# EasyEDA schematic asynch9.json
TITLE: Sheet_1; REV: 1.0; Date: 2019-11-25; Sheet: 1/1; Drawn By: bianevesgarrido; Company: Your Company
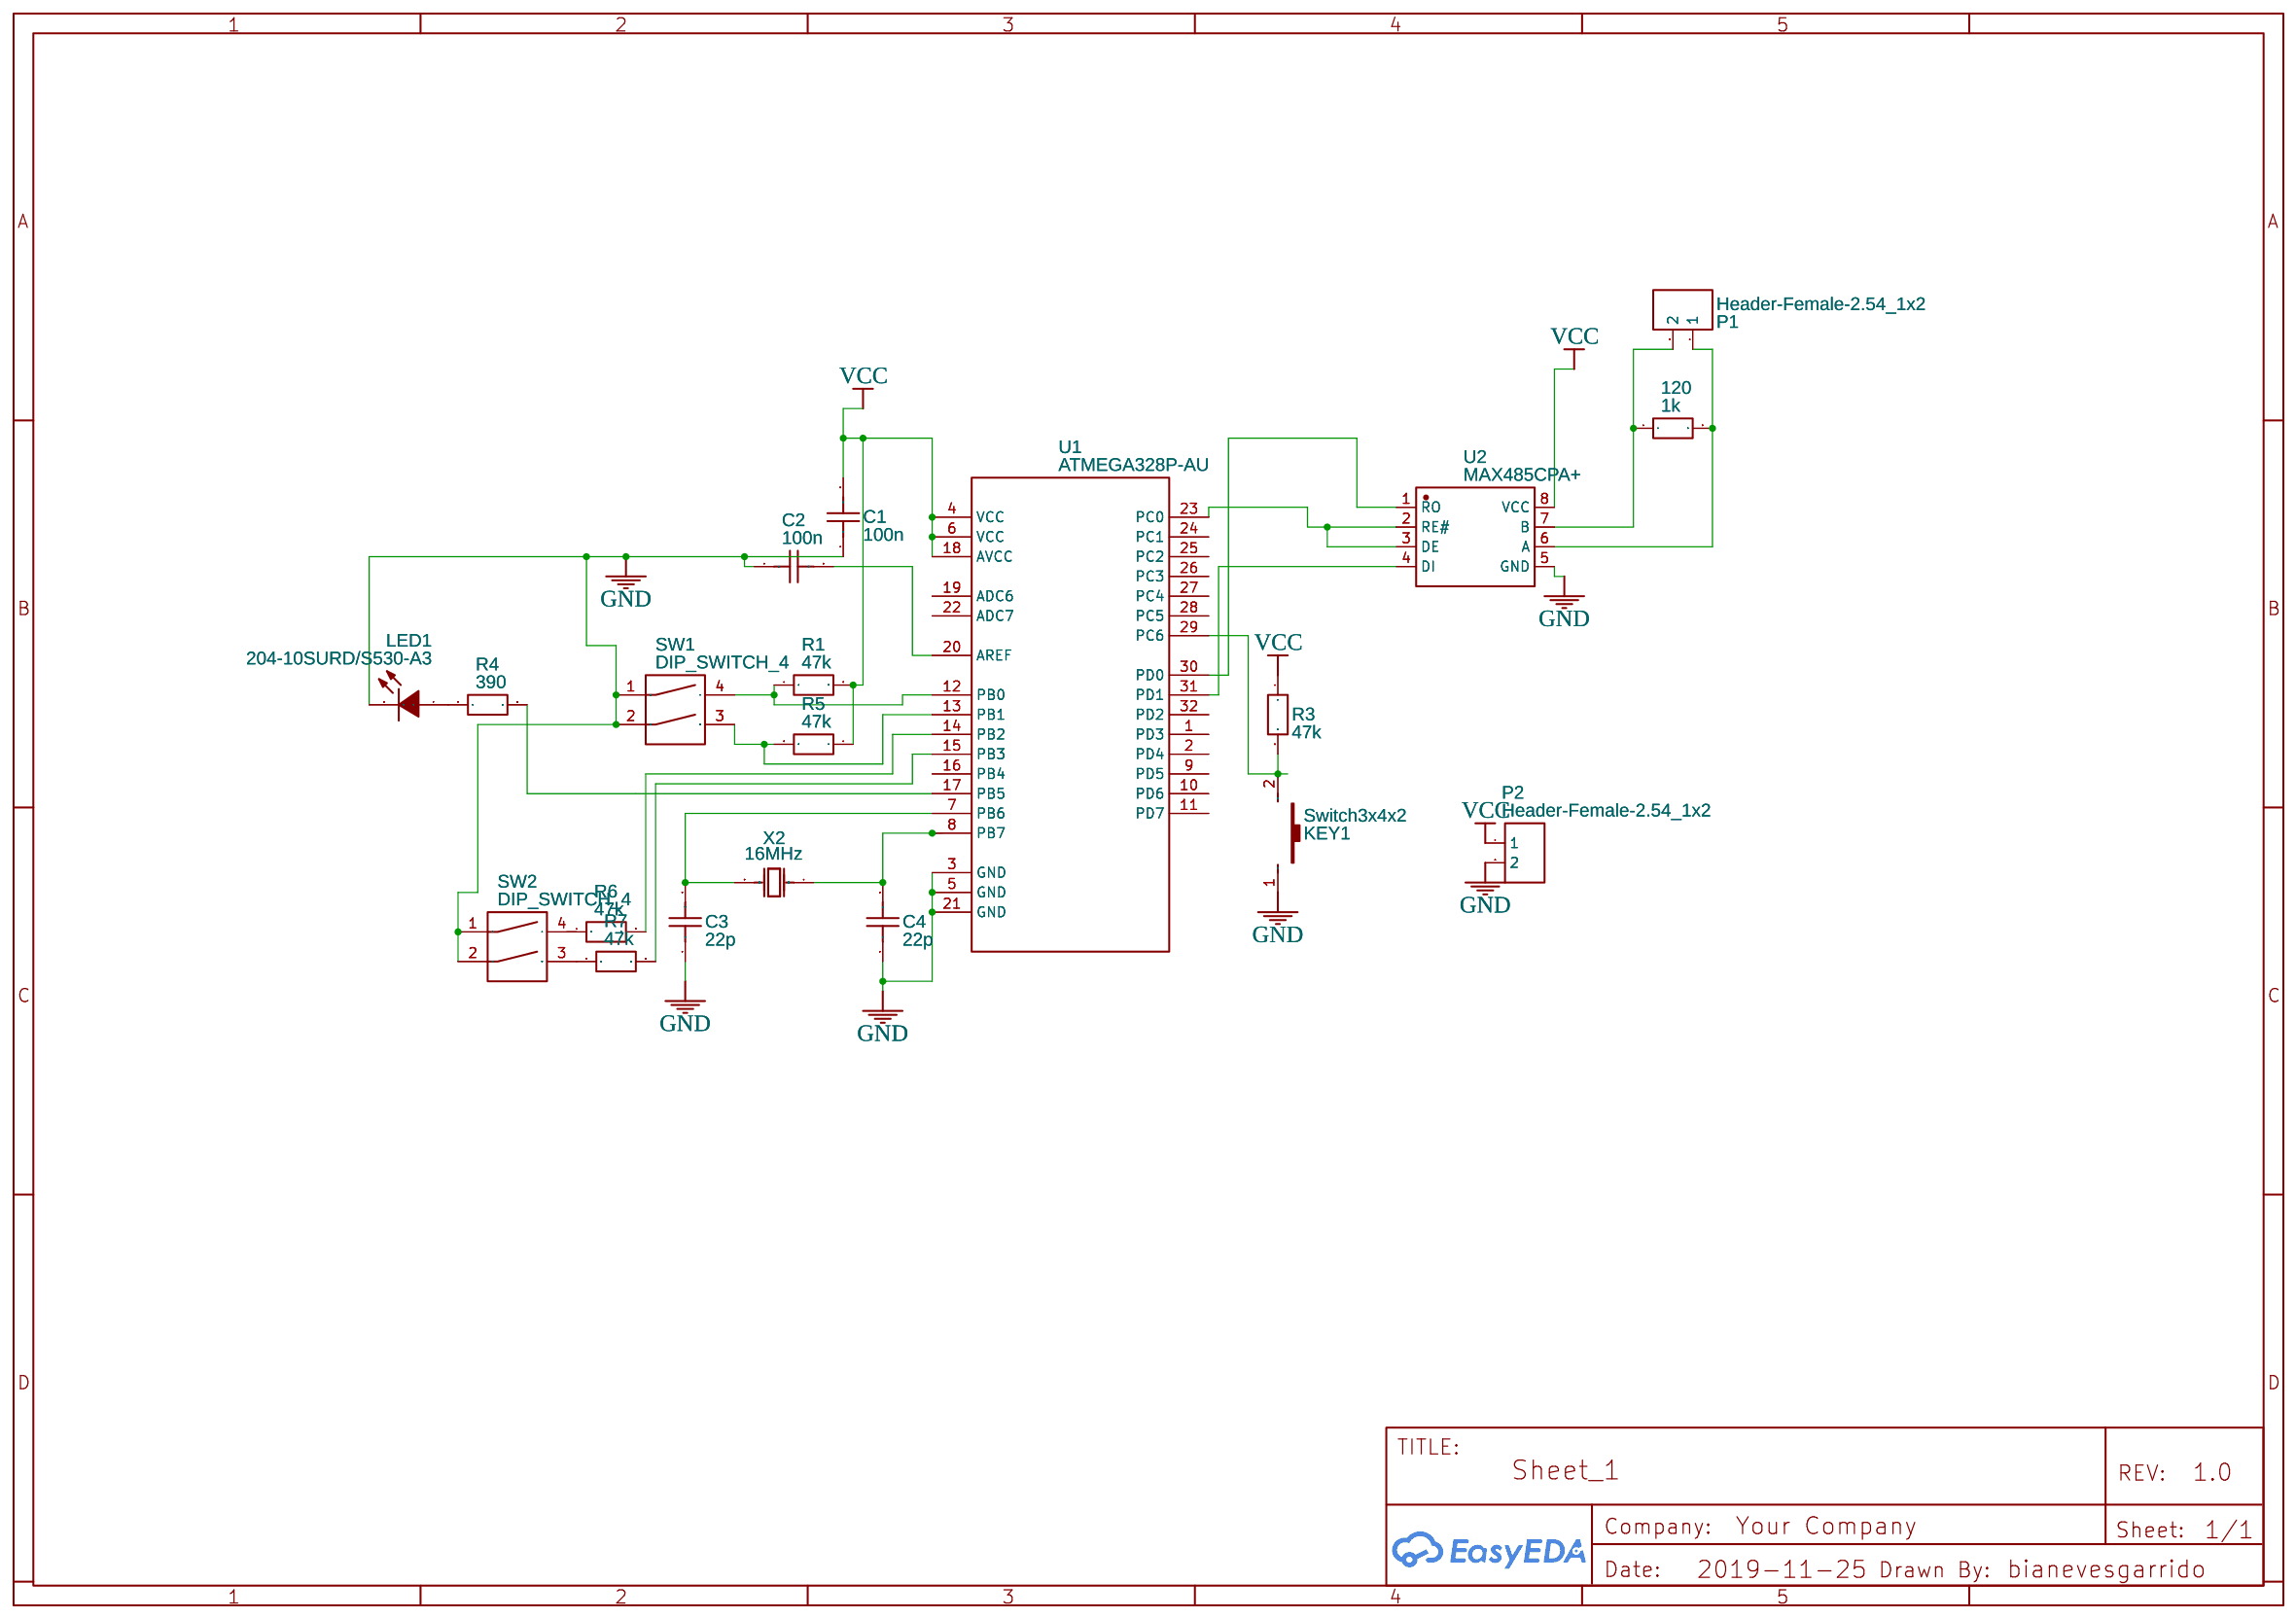
[diagram p0: schematic sheet]

## Parts
120  1k  [AXIAL-0.3]
C1  100n  [RAD-0.1]
C2  100n  [RAD-0.1]
C3  22p  [RAD-0.1]
C4  22p  [RAD-0.1]
KEY1  Switch3x4x2  [KEY-3.0*4.0]
LED1  204-10SURD/S530-A3  [LED-3MM/2.54]
P1  Header-Female-2.54_1x2  [HDR-1X2/2.54]
P2  Header-Female-2.54_1x2  [HDR-1X2/2.54]
R1  47k  [AXIAL-0.3]
R3  47k  [AXIAL-0.3]
R4  390  [AXIAL-0.3]
R5  47k  [AXIAL-0.3]
R6  47k  [AXIAL-0.3]
R7  47k  [AXIAL-0.3]
SW1  DIP_SWITCH_4
SW2  DIP_SWITCH_4
U1  ATMEGA328P-AU  [TQFP-32_L7.0-W7.0-P0.80-LS9.0-TL]
U2  MAX485CPA+  [DIP-8_L10.0-W6.5-P2.54-LS7.6-BL]
X2  16MHz  [HC-49US_L11.5-W4.5-P4.88]

## Library data of the parts
120 R1 R3-R7 = Res_AXIAL-0.3(1/8W)_EU
C1-C4 = Cap_RAD-0.1_US
KEY1 = -: Supplier: LCSC; Manufacturer: ReliaPro; Supplier Part: C26638
LED1 = -: Supplier: LCSC; Manufacturer: EVERLIGHT; Supplier Part: C99772
P1 P2 = -: Supplier: LCSC; Manufacturer: BOOMELE; Manufacturer Part: 2.54-1*2PFemale; image: //image.lceda.cn/szlcsc/C49661.jpg; Supplier Part: C49661
SW1 SW2 = -: Contributor: Tinkerforge
U1 = -: Supplier: LCSC; Manufacturer: MICROCHIP; image: //image.lceda.cn/szlcsc/C14877.jpg; Supplier Part: C14877; LCSC Assembly: Yes; SMT Type: Extend
U2 = -: Supplier: LCSC; Supplier Part: C77792; Manufacturer: Maxim Integrated; Contributor: LCSC
X2 = X49SD12MSD2SC: Supplier: LCSC; Manufacturer: YXC; Supplier Part: C16369

## Nets
GND: C1.1 C2.1 C3.1 C4.1 KEY1.1 LED1.2(K) P2.2 SW1.1 SW1.2 SW2.1 SW2.2 U1.3(GND) U1.5(GND) U1.21(GND) U2.5(GND)
VCC: C1.2 P2.1 R1.2 R3.1 R5.1 U1.4(VCC) U1.6(VCC) U1.18(AVCC) U2.8(VCC)
Net-(120-1): 120.1 P1.2 U2.7(B)
Net-(120-2): 120.2 P1.1 U2.6(A)
Net-(C2-2): C2.2 U1.20(AREF)
Net-(C3-2): C3.2 U1.7(PB6) X2.2(OSC2)
Net-(C4-2): C4.2 U1.8(PB7) X2.1(OSC1)
Net-(KEY1-2): KEY1.2 R3.2 U1.29(PC6)
Net-(LED1-1): LED1.1(A) R4.1
Net-(R1-1): R1.1 SW1.4 U1.12(PB0)
Net-(R4-2): R4.2 U1.17(PB5)
Net-(R5-2): R5.2 SW1.3 U1.13(PB1)
Net-(R6-2): R6.2 U1.14(PB2)
Net-(R7-1): R7.1 SW2.3
Net-(R7-2): R7.2 U1.15(PB3)
Net-(U1-23): U1.23(PC0) U2.2(RE#) U2.3(DE)
Net-(U1-30): U1.30(PD0) U2.1(RO)
Net-(U1-31): U1.31(PD1) U2.4(DI)

Not connected (* = marked no-connect by the designer): R6 1; SW2 4; U1 1(PD3) 2(PD4) 9(PD5) 10(PD6) 11(PD7) 16(PB4) 19(ADC6) 22(ADC7) 24(PC1) 25(PC2) 26(PC3) 27(PC4) 28(PC5) 32(PD2)
